# EAGLE design test_ckt_2 (EAGLE 7.2.0)
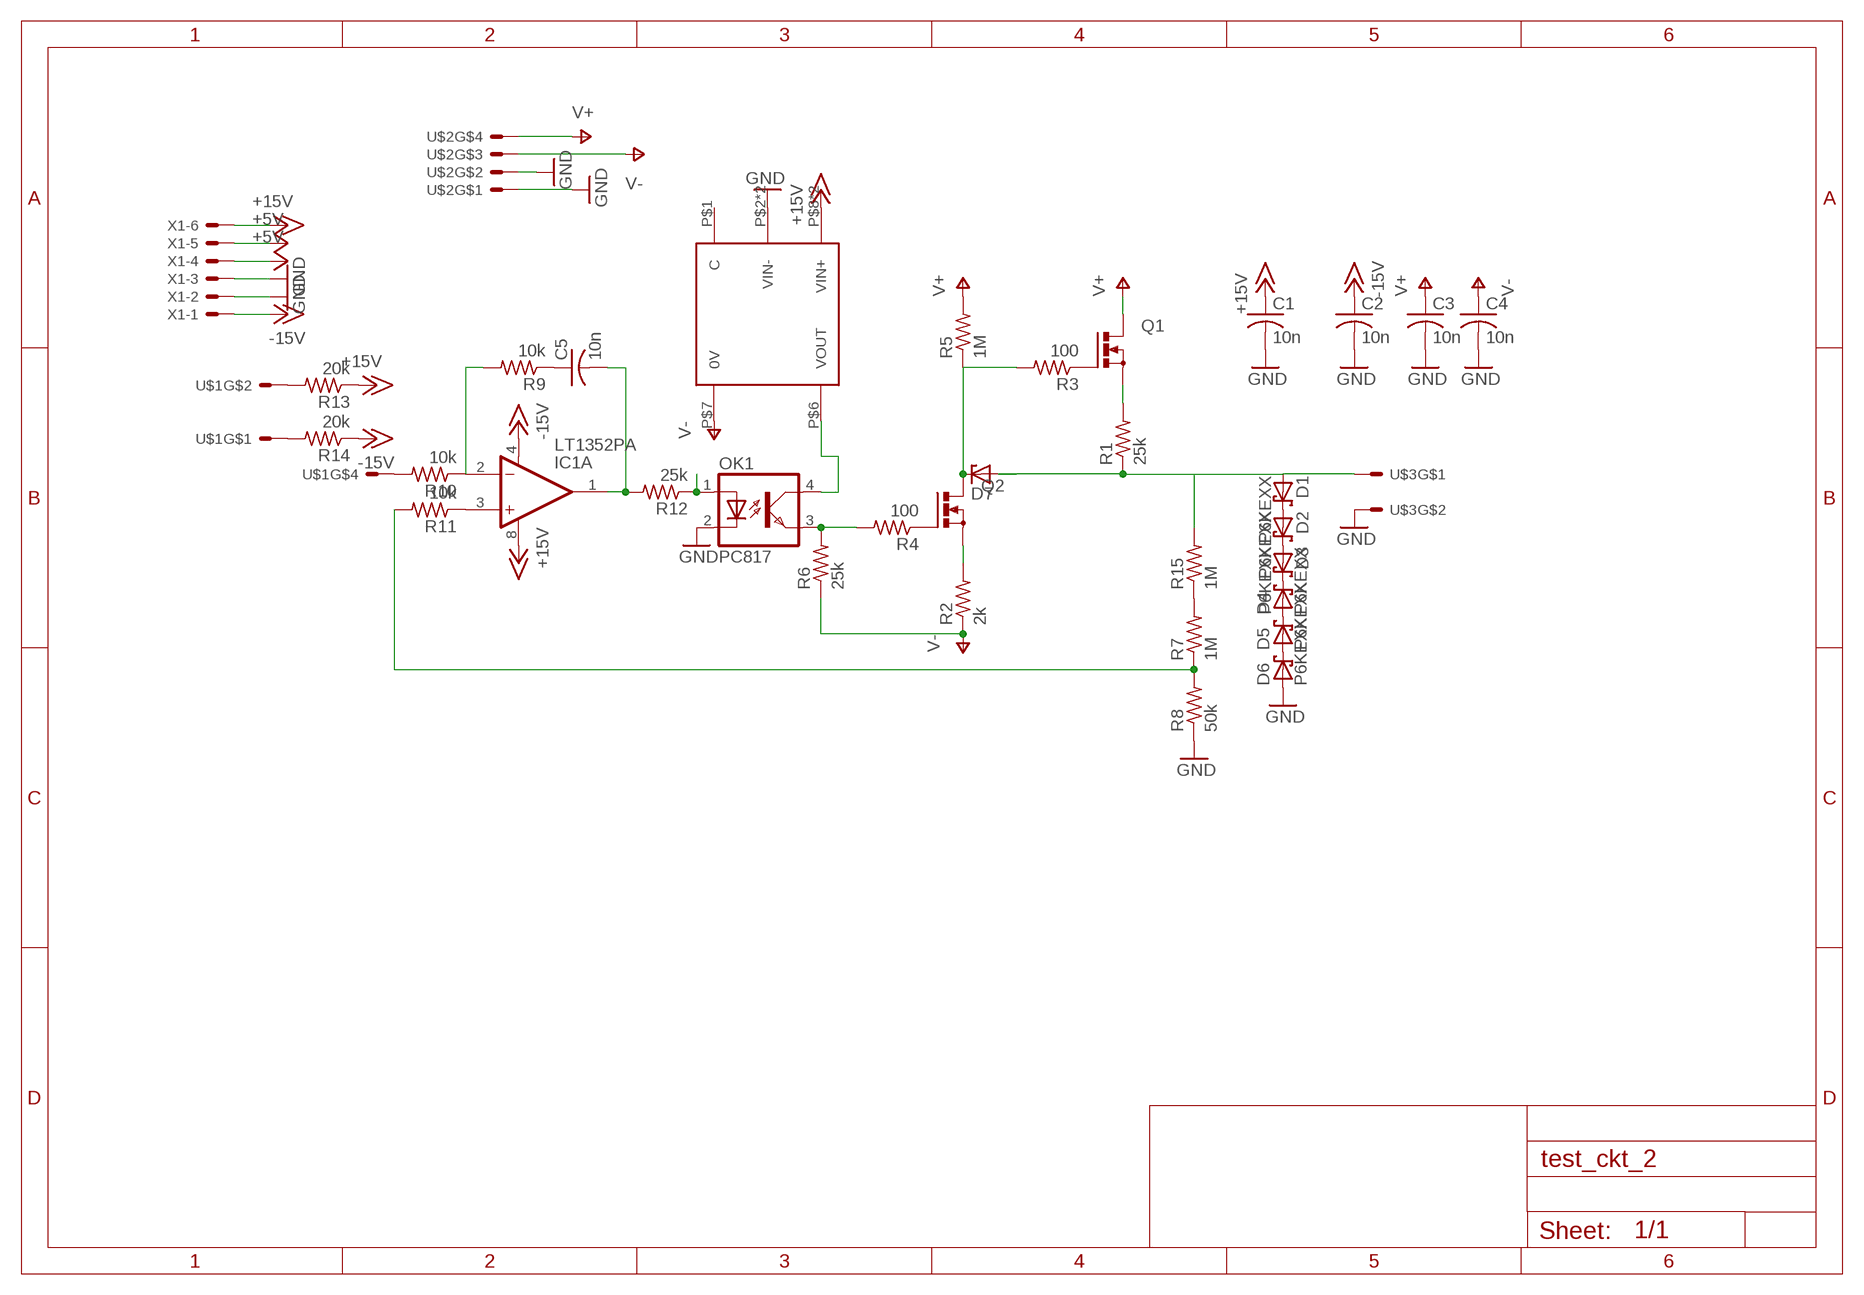
[diagram p0: schematic, sheet 1]

## Parts
C1  10n  C-US075-032X103  [C075-032X103]
C2  10n  C-US075-032X103  [C075-032X103]
C3  10n  C-US075-032X103  [C075-032X103]
C4  10n  C-US075-032X103  [C075-032X103]
C5  10n  C-US075-032X103  [C075-032X103]
D1  P6KEXX  [CB417-15]
D2  P6KEXX  [CB417-15]
D3  P6KEXX  [CB417-15]
D4  P6KEXX  [CB417-15]
D5  P6KEXX  [CB417-15]
D6  P6KEXX  [CB417-15]
D7  ZENER-DIODEZD-12.5  [ZDIO12.5]
DC1  NCS  [NCS]
IC1  LT1352PA  [DIL08]
OK1  PC817  [DIL04]
Q1  PMOSFET_NTO220BV  [TO220BV]
Q2  PMOSFET_NTO220BV  [TO220BV]
R1  25k  R-US_0207/10  [0207/10]
R2  2k  R-US_0207/10  [0207/10]
R3  100  R-US_0207/10  [0207/10]
R4  100  R-US_0207/10  [0207/10]
R5  1M  R-US_0414/15  [0414/15]
R6  25k  R-US_0207/10  [0207/10]
R7  1M  R-US_0414/15  [0414/15]
R8  50k  R-US_0207/10  [0207/10]
R9  10k  R-US_0207/10  [0207/10]
R10  10k  R-US_0207/10  [0207/10]
R11  10k  R-US_0207/10  [0207/10]
R12  25k  R-US_0207/15  [0207/15]
R13  20k  R-US_0207/10  [0207/10]
R14  20k  R-US_0207/10  [0207/10]
R15  1M  R-US_0414/15  [0414/15]
U$1  5569-4  [5669-4]
U$2  5569-4  [5669-4]
U$3  5569-2  [5569-2]
X1  KK-156-6  [KK-156-6]

## Nets
+5V: X1.4 X1.5
+15V: C1.1 DC1.P$8(VIN+) DC1.P$9(VIN+) IC1.8(A:V+) R13.1 X1.6
-15V: C2.1 IC1.4(A:V-) R14.1 X1.1
GND: C1.2 C2.2 C3.2 C4.2 D6.A DC1.P$2(VIN-) DC1.P$3(VIN-) OK1.2(C) R8.1 U$2.P$1 U$2.P$2 U$3.P$2 X1.2 X1.3
N$1: D1.C D2.A
N$2: D2.C D3.A
N$3: D3.C D4.C
N$4: D4.A D5.C
N$5: D5.A D6.C
N$6: Q1.G R3.1
N$7: D7.C Q2.D R3.2 R5.1
N$8: Q1.S R1.2
N$9: R13.2 U$1.P$2
N$10: D1.A D7.A R1.1 R15.2 U$3.P$1
N$11: Q2.G R4.1
N$12: OK1.3(EMIT) R4.2 R6.2
N$13: R10.2 U$1.P$4
N$14: Q2.S R2.2
N$16: DC1.P$6(VOUT) OK1.4(COL)
N$17: C5.1 R9.1
N$18: IC1.2(A:-IN) R9.2 R10.1
N$19: C5.2 IC1.1(A:OUT) R12.2
N$20: IC1.3(A:+IN) R11.1
N$21: R7.1 R8.2 R11.2
N$23: R7.2 R15.1
N$24: R14.2 U$1.P$1
N$25: OK1.1(A) R12.1
V+: C3.1 Q1.D R5.2 U$2.P$4
V-: C4.1 DC1.P$7(0V) R2.1 R6.1 U$2.P$3
Unconnected: DC1.P$1(C) IC1.5(B:+IN) IC1.6(B:-IN) IC1.7(B:OUT) U$1.P$3

## Library data of the parts
C1-C5 = rcl:C-US: CAPACITOR, American symbol
D1-D6 = diode:P6KEXX: DIODE transient-voltage suppressor
D7 = diode:ZENER-DIODE: Z-Diode
DC1 = dc-dc-converter:NCS: DC-DC CONVERTER
IC1 = linear-technology:LT1352: Dual Operational Amplifiers Source: http://datasheets.maxim-ic.com/en/ds/ICL7612-ICL764X.pdf; OC_FARNELL: unknown; OC_NEWARK: unknown
OK1 = optocoupler:PC817: SHARP OPTO COUPLER; MPN: PC817X4J000F; OC_FARNELL: 9707727; OC_NEWARK: 97K7059
Q1 Q2 = transistor-power:PMOSFET_N: Power MOSFET N-Channel
R1-R4 R6 R8-R14 = rcl:R-US_: RESISTOR, American symbol
R5 R7 R15 = resistor:R-US_: RESISTOR, American symbol
U$1 U$2 = con-molex:5569-4
U$3 = con-molex:5569-2
X1 = con-molex:KK-156-6: KK 156 HEADER Source: http://www.molex.com/pdm_docs/sd/026604100_sd.pdf; OC_FARNELL: unknown; OC_NEWARK: unknown

## Board
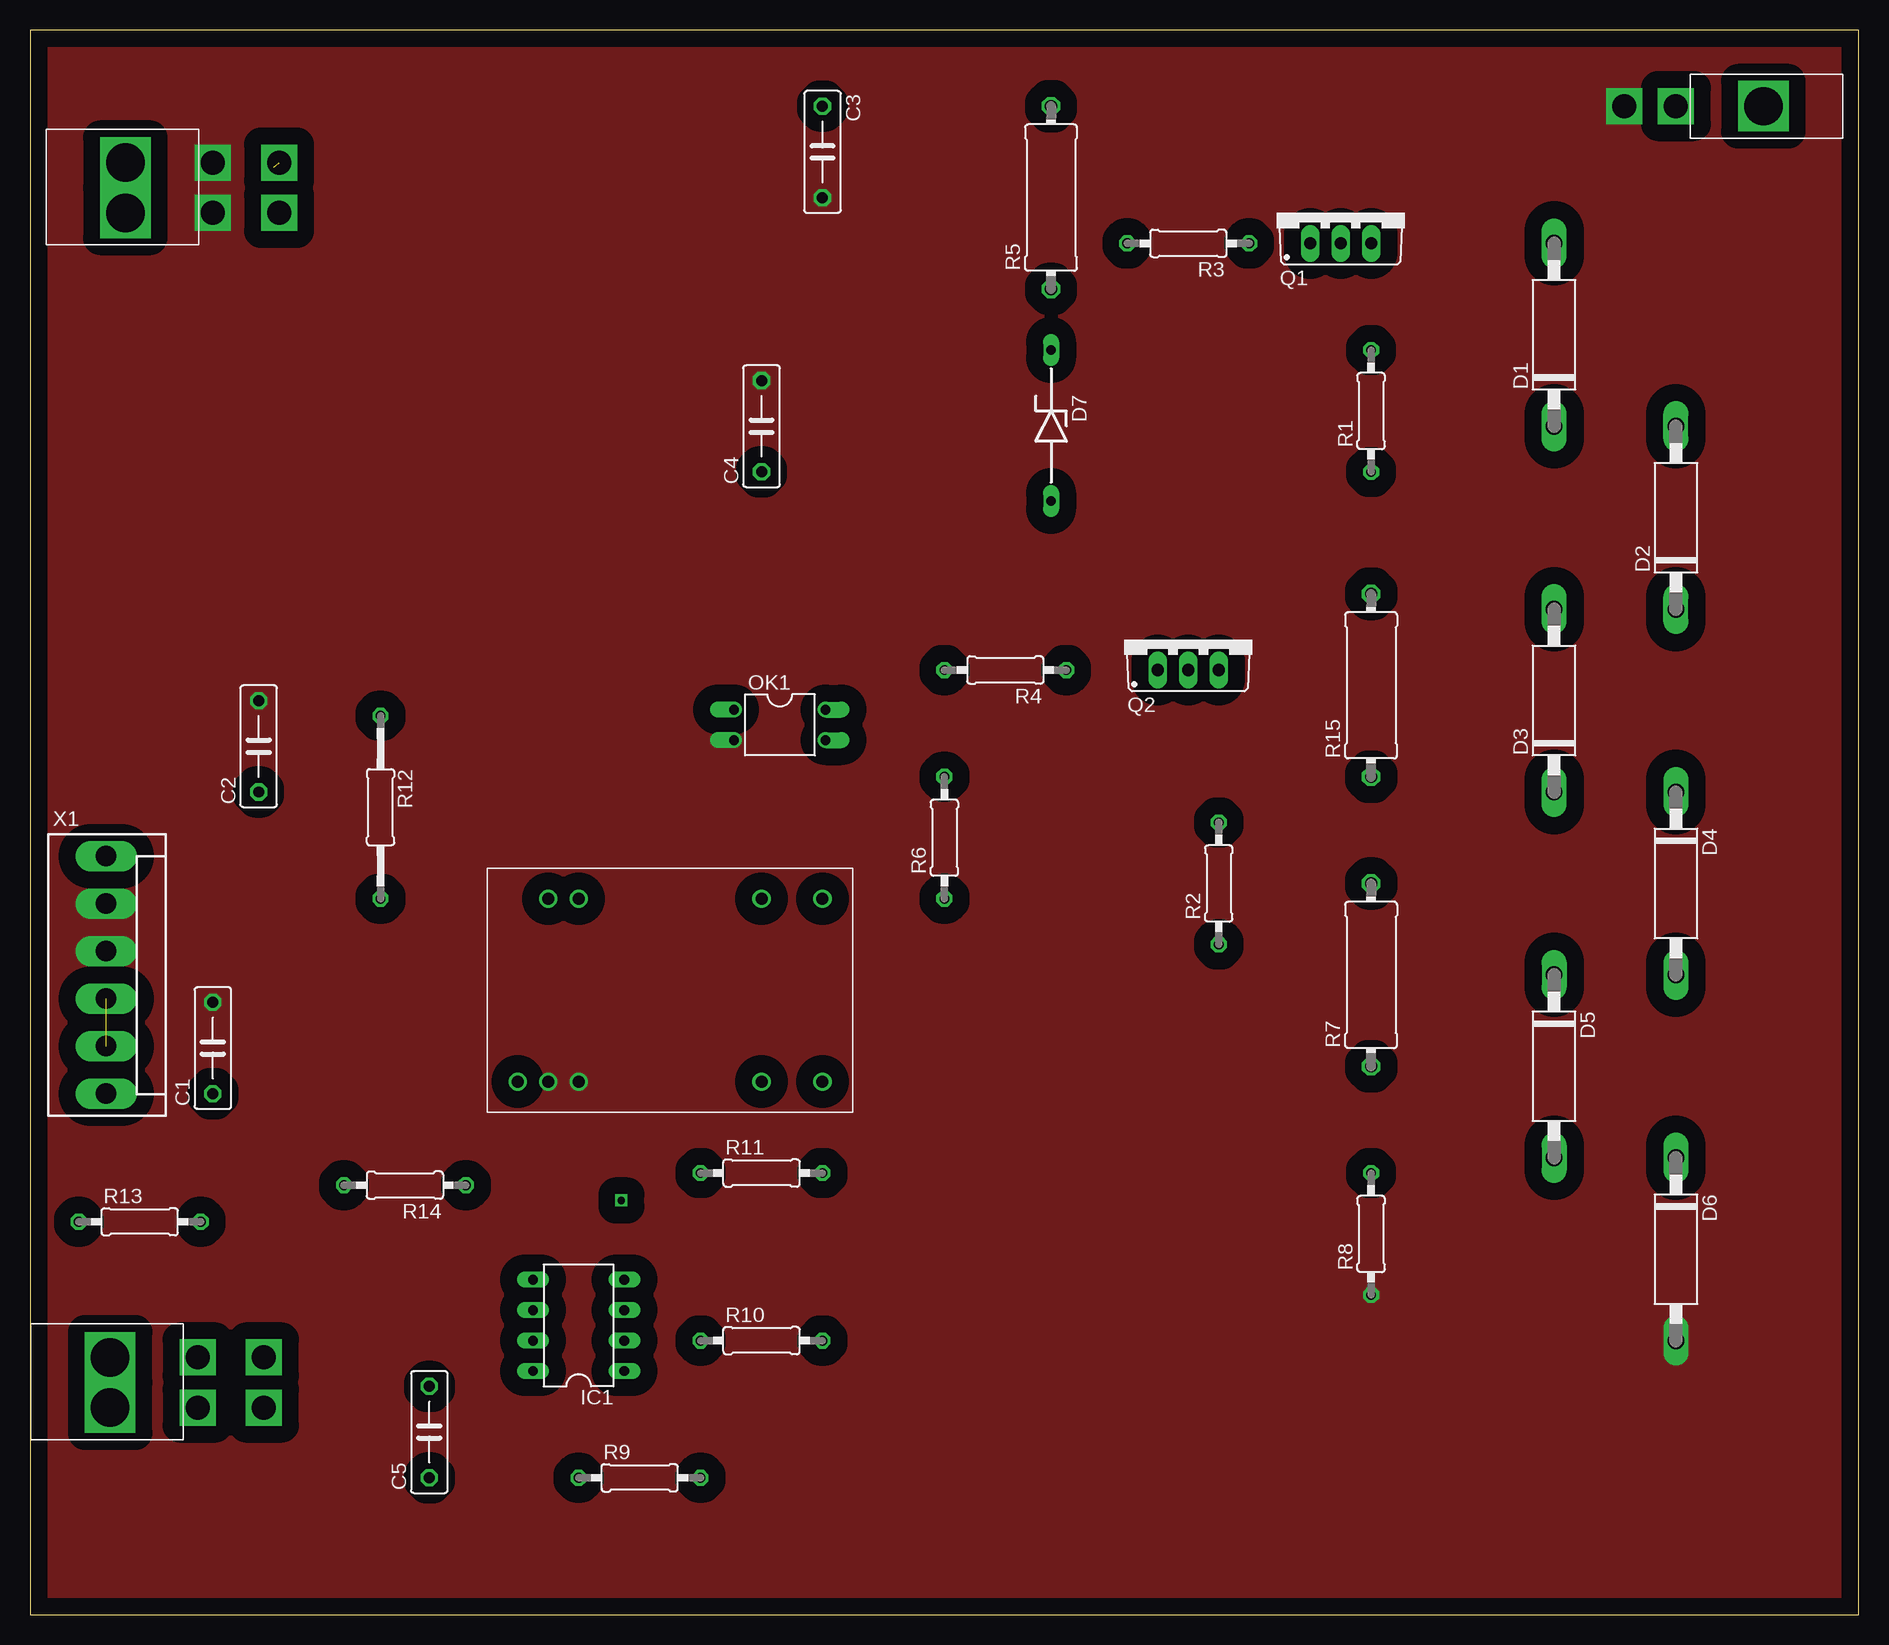
[diagram p1: board, top side]
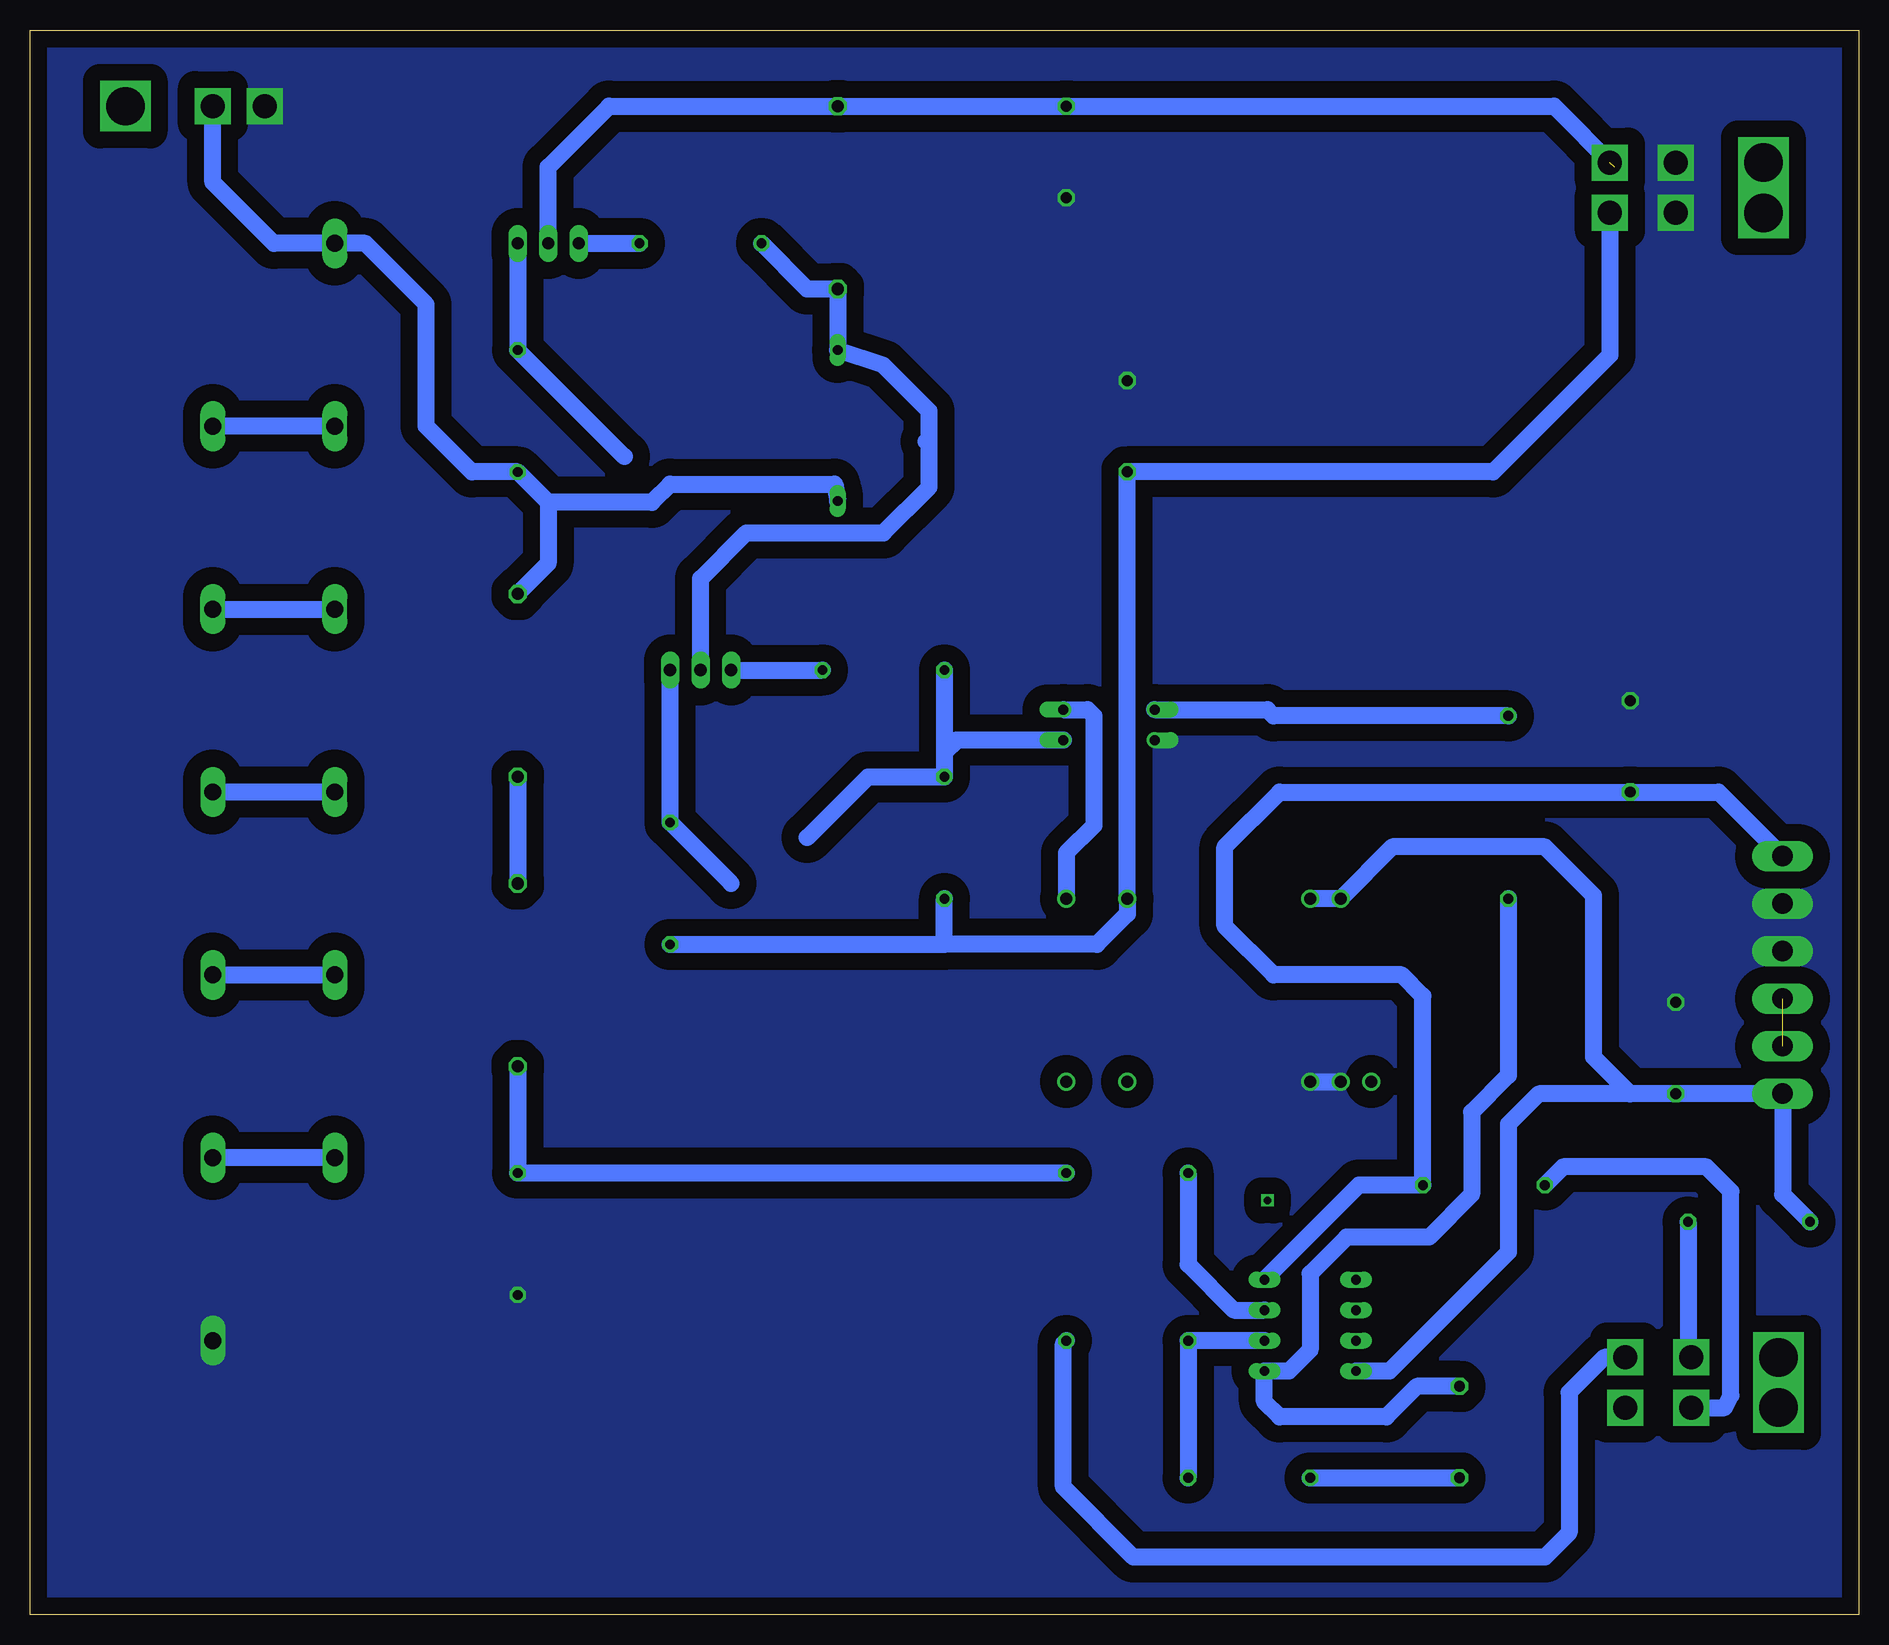
[diagram p2: board, bottom side, seen from below]

Size 152.4 x 132.08 mm. Coordinates in mm from the lower left corner, seen from the top.
Outline: 0,0 152.4,0 152.4,132.08 0,132.08 0,0
Copper layers (1*16): Top 0.035mm / dielectric 1.5mm / Bottom 0.035mm
Design rules "default": minimum track width 10mil, minimum drill 24mil, track to track 8mil, track to pad 8mil, pad to pad 8mil, via to via 8mil, smd to smd 8mil, copper to edge 40mil, drill to drill 8mil, minimum pad ring 10mil, minimum via ring 8mil, stop-mask expansion 4mil, vias tented up to drill 0mil, thermal gap 10mil

### Footprints (pad centres in the part's own frame; a part is rotated, then mirrored left to right if it is on the bottom)
C075-032X103 = drill 0.914 octagon: 1 -3.81,0; 2 3.81,0
CB417-15 = drill 1.397 long: A 7.62,0; C -7.62,0
ZDIO12.5 = drill 0.813 long: A 6.223,0; C -6.35,0
NCS = drill 1: P$1 0,0; P$2 2.54,0; P$3 5.08,0; P$4 20.32,0; P$5 25.4,0; P$6 25.4,15.24; P$7 20.32,15.24; P$8 5.08,15.24; P$9 2.54,15.24
DIL08 = drill 0.813 long: 1 -3.81,-3.81; 2 -1.27,-3.81; 3 1.27,-3.81; 4 3.81,-3.81; 5 3.81,3.81; 6 1.27,3.81; 7 -1.27,3.81; 8 -3.81,3.81
DIL04 = drill 0.813 offset: 1 -1.27,-3.81; 2 1.27,-3.81; 3 1.27,3.81; 4 -1.27,3.81
TO220BV = drill 1.016 long: D 0,-2.54; G -2.54,-2.54; S 2.54,-2.54
0207/10 = drill 0.813 octagon: 1 -5.08,0; 2 5.08,0
0414/15 = drill 1.016 octagon: 1 -7.62,0; 2 7.62,0
0207/15 = drill 0.813 octagon: 1 -7.62,0; 2 7.62,0
5669-4 = drill 2 square: P$1 0,0; P$2 -4.191,0; P$3 0,5.512; P$4 -4.191,5.512 | drill 3.2 square: P$5 0,-7.29; P$6 -4.191,-7.29
5569-2 = drill 2 square: P$1 0,0; P$2 0,4.318 | drill 3.2 square: P$4 0,-7.29
KK-156-6 = drill 1.7 pad 2.184 long: 1 -9.9,0; 2 -5.94,0; 3 -1.98,0; 4 1.98,0; 5 5.94,0; 6 9.9,0

### Placement (x,y rotation side)
C1  15.24,47.24 90 top
C2  19.05,72.39 90 top
C3  66.04,121.92 270 top
C4  60.96,99.06 90 top
C5  33.27,15.24 90 top
D1  127,106.68 90 top
D2  137.16,91.44 90 top
D3  127,76.2 90 top
D4  137.16,60.96 270 top
D5  127,45.72 270 top
D6  137.16,30.48 270 top
D7  85.09,99.06 270 top
DC1  40.64,44.45 0 top
IC1  45.72,24.13 90 top
OK1  62.48,74.17 270 top
Q1  109.22,116.84 0 top
Q2  96.52,81.28 0 top
R1  111.76,100.33 90 top
R2  99.06,60.96 90 top
R3  96.52,114.3 180 top
R4  81.28,78.74 180 top
R5  85.09,118.11 90 top
R6  76.2,64.77 90 top
R7  111.76,53.34 90 top
R8  111.76,31.75 90 top
R9  50.8,11.43 0 top
R10  60.96,22.86 0 top
R11  60.96,36.83 0 top
R12  29.21,67.31 270 top
R13  9.14,32.77 0 top
R14  31.24,35.81 180 top
R15  111.76,77.47 90 top
U$1  13.97,17.27 270 top
U$2  15.24,116.84 270 top
U$3  137.16,125.73 90 top
X1  6.35,53.34 270 top

### Tracks (layer width: path | path; a pad name or v marks a point on that pad's centre or on a via)
+5V  (1 unrouted)
+15V
  Bottom 1.422: R13.1 6.35,35.05 X1.6 C1.1 19.05,43.43 | 19.05,43.43 22.1,46.48 22.1,59.94 26.16,64.01 38.86,64.01 DC1.P$9 DC1.P$8 | 19.05,43.43 26.67,43.43 29.21,40.89 29.21,30.23 39.12,20.32 IC1.8
-15V
  Bottom 1.422: IC1.4 41.66,35.81 R14.1 36.32,51.56 38.1,53.34 48.77,53.34 52.83,57.4 52.83,64.01 48.26,68.58 C2.1 11.69,68.58 X1.1
GND
  Bottom 1.422: DC1.P$3 DC1.P$2
  pour Bottom (isolate 1.422, no thermals): 0,0 152.4,0 152.15,132.33 -0.76,132.08
  pour Top (isolate 1.422, no thermals): -0.51,131.83 152.15,132.33 152.4,-0.25 0,-0.25
N$1
  Bottom 1.422: D1.C D2.A
N$2
  Bottom 1.422: D2.C D3.A
N$3
  Bottom 1.422: D3.C D4.C
N$4
  Bottom 1.422: D4.A D5.C
N$5
  Bottom 1.422: D5.A D6.C
N$6
  Bottom 1.422: Q1.G R3.1
N$7
  Bottom 1.422: R3.2 87.63,110.49 R5.1 D7.C 81.28,104.14 77.47,100.33 77.47,98.04 | Q2.D 96.52,86.36 92.71,90.17 81.28,90.17 77.47,93.98 77.47,98.04 | 77.72,97.79 77.47,98.04
N$8
  Bottom 1.422: 102.87,96.52 R1.2 Q1.S
N$9
  Bottom 1.422: R13.2 14.22,21.72 U$1.P$2
N$10
  Bottom 1.422: U$3.P$1 137.16,119.38 132.08,114.3 D1.A 124.46,114.3 119.38,109.22 119.38,99.06 115.57,95.25 R1.1 109.22,92.71 | 109.22,92.71 100.58,92.71 99.06,94.23 85.34,94.23 D7.A | 109.22,92.71 109.22,87.63 R15.2
N$11
  Bottom 1.422: Q2.G R4.1
N$12
  Bottom 1.422: R4.2 76.2,72.14 | 76.2,72.14 76.2,71.88 | 76.2,71.88 R6.2 82.55,69.85 87.63,64.77 | 75.95,72.39 76.2,72.14 | OK1.3 75.18,72.9 76.2,71.88
N$13
  Bottom 1.422: U$1.P$4 21.21,21.46 24.13,18.54 24.13,6.86 26.16,4.83 60.45,4.83 66.29,10.67 66.29,22.61 R10.2
N$14
  Bottom 1.422: 93.98,60.96 R2.2 Q2.S
N$15  (via drill 0.6)
  other vias: 49.28,34.54
N$16
  Bottom 1.422: DC1.P$6 66.04,63.5 63.75,65.79 63.75,74.93 64.26,75.44 OK1.4
N$17
  Bottom 1.422: R9.1 C5.1
N$18
  Bottom 1.422: IC1.2 R10.1 R9.2
N$19
  Bottom 1.422: C5.2 36.83,19.05 39.37,16.51 48.26,16.51 49.53,17.78 IC1.1 47.5,20.32 45.72,22.1 45.72,28.45 42.67,31.5 35.81,31.5 32.26,35.05 32.26,41.91 29.21,44.96 R12.2
N$20
  Bottom 1.422: R11.1 55.88,29.21 52.07,25.4 IC1.3
N$21
  Bottom 1.422: R7.1 R8.2 R11.2
N$23
  Bottom 1.422: R15.1 R7.2
N$24
  Bottom 1.422: U$1.P$1 11.18,17.27 10.67,18.29 10.67,35.31 12.7,37.34 24.64,37.34 R14.2
N$25
  Bottom 1.422: R12.1 48.77,74.93 49.28,75.44 OK1.1
V+  (1 unrouted)
  Bottom 1.422: Q1.D 109.22,120.65 104.14,125.73 R5.2 C3.1 25.4,125.73 20.32,120.65
V-
  Bottom 1.422: 76.2,55.88 87.63,55.88 R2.1 | 76.2,55.88 63.5,55.88 60.96,58.42 DC1.P$7 C4.1 30.48,95.25 20.75,104.98 U$2.P$3 | 76.2,55.88 R6.1

### Text on the board
tDocu: 2n3904 are on reverse side!!! | 2n3904 are on reverse side!!!